# Altium schematic sheet Connectors.SchDoc
size A
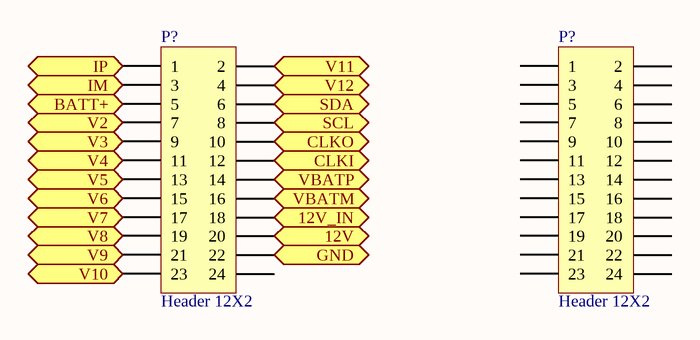
[diagram p0: Connectors.SchDoc]

## Parts
(Parts that share a designator on the sheet are numbered #1, #2 ... from top to bottom, then left to right.)
P?#1  Header 12X2  [HDR2X12]
P?#2  Header 12X2  [HDR2X12]

## Ports
12V (bidir), 12V_IN (bidir), BATT+ (bidir), CLKI (bidir), CLKO (bidir), GND (bidir), IM (bidir), IP (bidir), SCL (bidir), SDA (bidir), V2 (bidir), V3 (bidir), V4 (bidir), V5 (bidir), V6 (bidir), V7 (bidir), V8 (bidir), V9 (bidir), V10 (bidir), V11 (bidir), V12 (bidir), VBATM (bidir), VBATP (bidir)

## Nets
12V: P?#1.20 ; port 12V
12V_IN: P?#1.18 ; port 12V_IN
BATT+: P?#1.5 ; port BATT+
CLKI: P?#1.12 ; port CLKI
CLKO: P?#1.10 ; port CLKO
GND: P?#1.22 ; port GND
IM: P?#1.3 ; port IM
IP: P?#1.1 ; port IP
SCL: P?#1.8 ; port SCL
SDA: P?#1.6 ; port SDA
V2: P?#1.7 ; port V2
V3: P?#1.9 ; port V3
V4: P?#1.11 ; port V4
V5: P?#1.13 ; port V5
V6: P?#1.15 ; port V6
V7: P?#1.17 ; port V7
V8: P?#1.19 ; port V8
V9: P?#1.21 ; port V9
V10: P?#1.23 ; port V10
V11: P?#1.2 ; port V11
V12: P?#1.4 ; port V12
VBATM: P?#1.16 ; port VBATM
VBATP: P?#1.14 ; port VBATP

Not connected (* = marked no-connect by the designer): P?#1 24; P?#2 1 2 3 4 5 6 7 8 9 10 11 12 13 14 15 16 17 18 19 20 21 22 23 24

## Library data of the parts
P?#1 P?#2 = Header 12X2: Header, 12-Pin, Dual row; LatestRevisionDate: 17-Jul-2002; LatestRevisionNote: Re-released for DXP Platform.; Publisher: Altium Limited